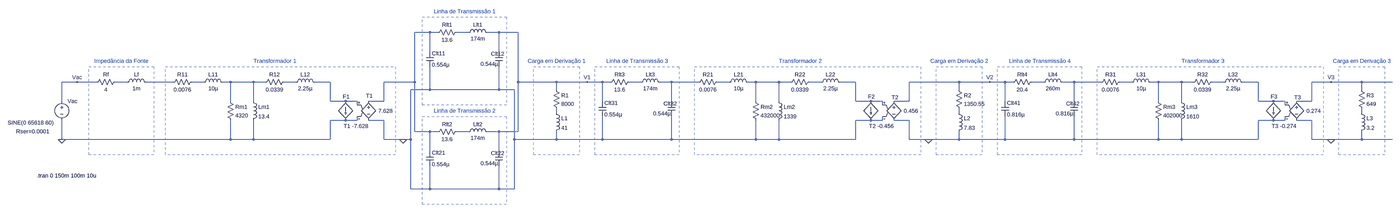
[diagram p0: schematic SEP.asc, whole sheet]
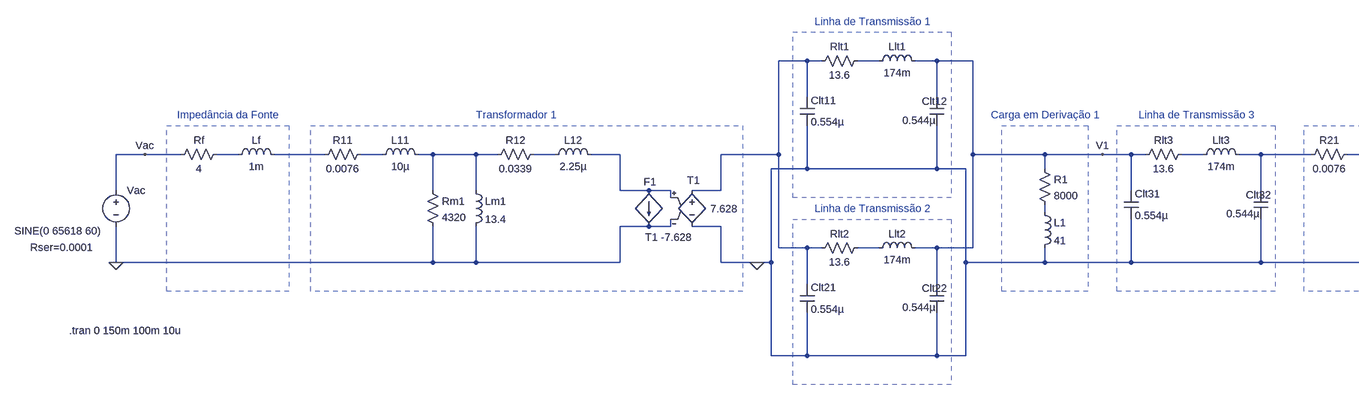
[diagram p1: schematic SEP.asc, part, row 1 of 1, column 1 of 2]
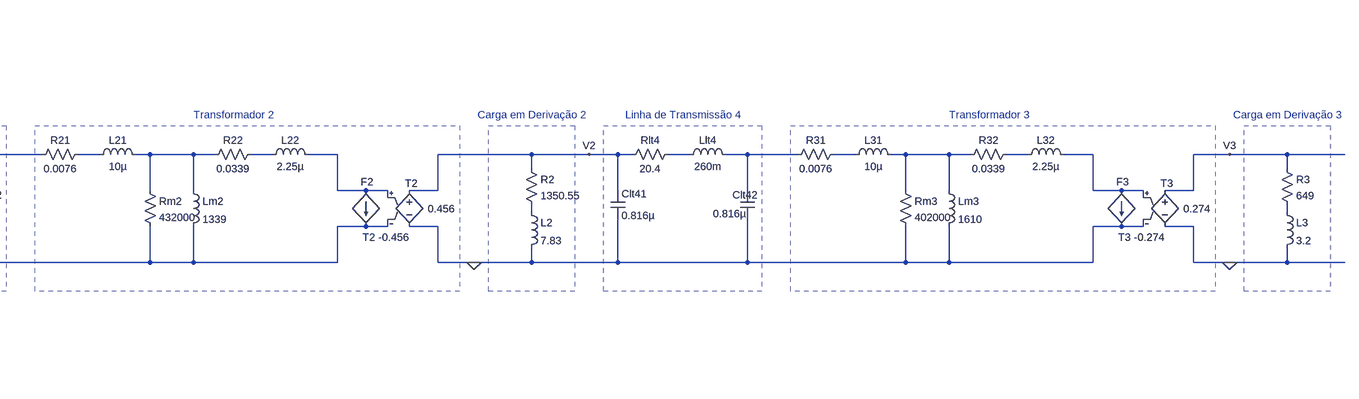
[diagram p2: schematic SEP.asc, part, row 1 of 1, column 2 of 2]
SEP.asc, the LTspice schematic file:
Version 4
SHEET 1 4708 936
WIRE 176 -112 112 -112
WIRE 208 -112 176 -112
WIRE 336 -112 288 -112
WIRE 464 -112 416 -112
WIRE 544 -112 464 -112
WIRE 176 -32 176 -112
WIRE 464 -32 464 -112
WIRE -1296 96 -1360 96
WIRE -1216 96 -1296 96
WIRE -1088 96 -1136 96
WIRE -896 96 -1008 96
WIRE -768 96 -816 96
WIRE -656 96 -688 96
WIRE -560 96 -656 96
WIRE -512 96 -560 96
WIRE -384 96 -432 96
WIRE -240 96 -304 96
WIRE 112 96 112 -112
WIRE 112 96 -16 96
WIRE 544 96 544 -112
WIRE 704 96 544 96
WIRE 832 96 704 96
WIRE 896 96 832 96
WIRE 928 96 896 96
WIRE 1056 96 1008 96
WIRE 1184 96 1136 96
WIRE 1296 96 1184 96
WIRE 1424 96 1376 96
WIRE 1536 96 1504 96
WIRE 1632 96 1536 96
WIRE 1680 96 1632 96
WIRE 1808 96 1760 96
WIRE 1952 96 1888 96
WIRE 2384 96 2176 96
WIRE 2512 96 2384 96
WIRE 2576 96 2512 96
WIRE 2608 96 2576 96
WIRE 2736 96 2688 96
WIRE 2864 96 2816 96
WIRE 2976 96 2864 96
WIRE 3104 96 3056 96
WIRE 3216 96 3184 96
WIRE 3312 96 3216 96
WIRE 3360 96 3312 96
WIRE 3488 96 3440 96
WIRE 3632 96 3568 96
WIRE 3936 96 3856 96
WIRE 4064 96 3936 96
WIRE 4192 96 4064 96
WIRE 176 128 176 32
WIRE 176 128 96 128
WIRE 464 128 464 32
WIRE 464 128 176 128
WIRE 528 128 464 128
WIRE 704 128 704 96
WIRE 2384 128 2384 96
WIRE 4064 128 4064 96
WIRE -1360 176 -1360 96
WIRE -656 176 -656 96
WIRE -560 176 -560 96
WIRE -240 176 -240 96
WIRE -176 176 -240 176
WIRE -128 176 -176 176
WIRE -16 176 -16 96
WIRE -16 176 -80 176
WIRE 896 176 896 96
WIRE 1184 176 1184 96
WIRE 1536 176 1536 96
WIRE 1632 176 1632 96
WIRE 1952 176 1952 96
WIRE 2016 176 1952 176
WIRE 2064 176 2016 176
WIRE 2176 176 2176 96
WIRE 2176 176 2112 176
WIRE 2576 176 2576 96
WIRE 2864 176 2864 96
WIRE 3216 176 3216 96
WIRE 3312 176 3312 96
WIRE 3632 176 3632 96
WIRE 3696 176 3632 176
WIRE 3744 176 3696 176
WIRE 3856 176 3856 96
WIRE 3856 176 3792 176
WIRE -128 192 -128 176
WIRE 2064 192 2064 176
WIRE 3744 192 3744 176
WIRE 704 224 704 208
WIRE 2384 224 2384 208
WIRE 4064 224 4064 208
WIRE -176 256 -240 256
WIRE -128 256 -128 240
WIRE -128 256 -176 256
WIRE -16 256 -80 256
WIRE 2016 256 1952 256
WIRE 2064 256 2064 240
WIRE 2064 256 2016 256
WIRE 2176 256 2112 256
WIRE 3696 256 3632 256
WIRE 3744 256 3744 240
WIRE 3744 256 3696 256
WIRE 3856 256 3792 256
WIRE 112 304 112 96
WIRE 176 304 112 304
WIRE 208 304 176 304
WIRE 336 304 288 304
WIRE 464 304 416 304
WIRE 544 304 544 96
WIRE 544 304 464 304
WIRE -1360 336 -1360 256
WIRE -656 336 -656 256
WIRE -656 336 -1360 336
WIRE -560 336 -560 256
WIRE -560 336 -656 336
WIRE -240 336 -240 256
WIRE -240 336 -560 336
WIRE -16 336 -16 256
WIRE 64 336 -16 336
WIRE 96 336 96 128
WIRE 96 336 64 336
WIRE 528 336 528 128
WIRE 704 336 704 304
WIRE 704 336 528 336
WIRE 896 336 896 240
WIRE 896 336 704 336
WIRE 1184 336 1184 240
WIRE 1184 336 896 336
WIRE 1536 336 1536 256
WIRE 1536 336 1184 336
WIRE 1632 336 1632 256
WIRE 1632 336 1536 336
WIRE 1952 336 1952 256
WIRE 1952 336 1632 336
WIRE 2176 336 2176 256
WIRE 2256 336 2176 336
WIRE 2384 336 2384 304
WIRE 2384 336 2256 336
WIRE 2576 336 2576 240
WIRE 2576 336 2384 336
WIRE 2864 336 2864 240
WIRE 2864 336 2576 336
WIRE 3216 336 3216 256
WIRE 3216 336 2864 336
WIRE 3312 336 3312 256
WIRE 3312 336 3216 336
WIRE 3632 336 3632 256
WIRE 3632 336 3312 336
WIRE 3856 336 3856 256
WIRE 3936 336 3856 336
WIRE 4064 336 4064 304
WIRE 4064 336 3936 336
WIRE 4192 336 4064 336
WIRE 176 384 176 304
WIRE 464 384 464 304
WIRE 96 544 96 336
WIRE 176 544 176 448
WIRE 176 544 96 544
WIRE 464 544 464 448
WIRE 464 544 176 544
WIRE 528 544 528 336
WIRE 528 544 464 544
FLAG -1360 336 0
FLAG 64 336 0
FLAG 2256 336 0
FLAG 832 96 V1
FLAG 2512 96 V2
FLAG -1296 96 Vac
FLAG 3936 96 V3
FLAG 3936 336 0
SYMBOL res -1120 80 R90
WINDOW 0 0 56 VBottom 2
WINDOW 3 32 56 VTop 2
SYMATTR InstName Rf
SYMATTR Value 4
SYMBOL ind -1104 112 R270
WINDOW 0 32 56 VTop 2
WINDOW 3 5 56 VBottom 2
SYMATTR InstName Lf
SYMATTR Value 1m
SYMBOL res -800 80 R90
WINDOW 0 0 56 VBottom 2
WINDOW 3 32 56 VTop 2
SYMATTR InstName R11
SYMATTR Value 0.0076
SYMBOL ind -784 112 R270
WINDOW 0 32 56 VTop 2
WINDOW 3 5 56 VBottom 2
SYMATTR InstName L11
SYMATTR Value 10µ
SYMBOL res -672 160 R0
SYMATTR InstName Rm1
SYMATTR Value 4320
SYMBOL ind -576 160 R0
SYMATTR InstName Lm1
SYMATTR Value 13.4
SYMBOL res -416 80 R90
WINDOW 0 0 56 VBottom 2
WINDOW 3 32 56 VTop 2
SYMATTR InstName R12
SYMATTR Value 0.0339
SYMBOL ind -400 112 R270
WINDOW 0 32 56 VTop 2
WINDOW 3 5 56 VBottom 2
SYMATTR InstName L12
SYMATTR Value 2.25µ
SYMBOL voltage -1360 160 R0
WINDOW 3 -226 106 Left 2
WINDOW 123 0 0 Left 0
WINDOW 39 -191 143 Left 2
SYMATTR Value SINE(0 65618 60)
SYMATTR SpiceLine Rser=0.0001
SYMATTR InstName Vac
SYMBOL res 688 112 R0
SYMATTR InstName R1
SYMATTR Value 8000
SYMBOL ind 688 208 R0
SYMATTR InstName L1
SYMATTR Value 41
SYMBOL cap 160 -32 R0
SYMATTR InstName Clt11
SYMATTR Value 0.554µ
SYMBOL res 304 -128 R90
WINDOW 0 0 56 VBottom 2
WINDOW 3 32 56 VTop 2
SYMATTR InstName Rlt1
SYMATTR Value 13.6
SYMBOL ind 320 -96 R270
WINDOW 0 32 56 VTop 2
WINDOW 3 5 56 VBottom 2
SYMATTR InstName Llt1
SYMATTR Value 174m
SYMBOL cap 448 -32 R0
WINDOW 0 -17 10 Left 2
WINDOW 3 -61 52 Left 2
SYMATTR InstName Clt12
SYMATTR Value 0.544µ
SYMBOL e -80 160 R0
WINDOW 0 -11 -6 Left 2
WINDOW 3 41 57 Left 2
SYMATTR InstName T1
SYMATTR Value 7.628
SYMBOL cap 160 384 R0
SYMATTR InstName Clt21
SYMATTR Value 0.554µ
SYMBOL res 304 288 R90
WINDOW 0 0 56 VBottom 2
WINDOW 3 32 56 VTop 2
SYMATTR InstName Rlt2
SYMATTR Value 13.6
SYMBOL ind 320 320 R270
WINDOW 0 32 56 VTop 2
WINDOW 3 5 56 VBottom 2
SYMATTR InstName Llt2
SYMATTR Value 174m
SYMBOL cap 448 384 R0
WINDOW 0 -17 10 Left 2
WINDOW 3 -61 52 Left 2
SYMATTR InstName Clt22
SYMATTR Value 0.544µ
SYMBOL cap 880 176 R0
SYMATTR InstName Clt31
SYMATTR Value 0.554µ
SYMBOL res 1024 80 R90
WINDOW 0 0 56 VBottom 2
WINDOW 3 32 56 VTop 2
SYMATTR InstName Rlt3
SYMATTR Value 13.6
SYMBOL ind 1040 112 R270
WINDOW 0 32 56 VTop 2
WINDOW 3 5 56 VBottom 2
SYMATTR InstName Llt3
SYMATTR Value 174m
SYMBOL cap 1168 176 R0
WINDOW 0 -17 10 Left 2
WINDOW 3 -61 52 Left 2
SYMATTR InstName Clt32
SYMATTR Value 0.544µ
SYMBOL res 1392 80 R90
WINDOW 0 0 56 VBottom 2
WINDOW 3 32 56 VTop 2
SYMATTR InstName R21
SYMATTR Value 0.0076
SYMBOL ind 1408 112 R270
WINDOW 0 32 56 VTop 2
WINDOW 3 5 56 VBottom 2
SYMATTR InstName L21
SYMATTR Value 10µ
SYMBOL res 1520 160 R0
SYMATTR InstName Rm2
SYMATTR Value 432000
SYMBOL ind 1616 160 R0
SYMATTR InstName Lm2
SYMATTR Value 1339
SYMBOL res 1776 80 R90
WINDOW 0 0 56 VBottom 2
WINDOW 3 32 56 VTop 2
SYMATTR InstName R22
SYMATTR Value 0.0339
SYMBOL ind 1792 112 R270
WINDOW 0 32 56 VTop 2
WINDOW 3 5 56 VBottom 2
SYMATTR InstName L22
SYMATTR Value 2.25µ
SYMBOL res 2368 112 R0
SYMATTR InstName R2
SYMATTR Value 1350.55
SYMBOL ind 2368 208 R0
SYMATTR InstName L2
SYMATTR Value 7.83
SYMBOL cap 2560 176 R0
SYMATTR InstName Clt41
SYMATTR Value 0.816µ
SYMBOL res 2704 80 R90
WINDOW 0 0 56 VBottom 2
WINDOW 3 32 56 VTop 2
SYMATTR InstName Rlt4
SYMATTR Value 20.4
SYMBOL ind 2720 112 R270
WINDOW 0 32 56 VTop 2
WINDOW 3 5 56 VBottom 2
SYMATTR InstName Llt4
SYMATTR Value 260m
SYMBOL cap 2848 176 R0
WINDOW 0 -17 10 Left 2
WINDOW 3 -61 52 Left 2
SYMATTR InstName Clt42
SYMATTR Value 0.816µ
SYMBOL res 3072 80 R90
WINDOW 0 0 56 VBottom 2
WINDOW 3 32 56 VTop 2
SYMATTR InstName R31
SYMATTR Value 0.0076
SYMBOL ind 3088 112 R270
WINDOW 0 32 56 VTop 2
WINDOW 3 5 56 VBottom 2
SYMATTR InstName L31
SYMATTR Value 10µ
SYMBOL res 3200 160 R0
SYMATTR InstName Rm3
SYMATTR Value 402000
SYMBOL ind 3296 160 R0
SYMATTR InstName Lm3
SYMATTR Value 1610
SYMBOL res 3456 80 R90
WINDOW 0 0 56 VBottom 2
WINDOW 3 32 56 VTop 2
SYMATTR InstName R32
SYMATTR Value 0.0339
SYMBOL ind 3472 112 R270
WINDOW 0 32 56 VTop 2
WINDOW 3 5 56 VBottom 2
SYMATTR InstName L32
SYMATTR Value 2.25µ
SYMBOL res 4048 112 R0
SYMATTR InstName R3
SYMATTR Value 649
SYMBOL ind 4048 208 R0
SYMATTR InstName L3
SYMATTR Value 3.2
SYMBOL e 3792 160 R0
WINDOW 0 -10 0 Left 2
WINDOW 3 41 57 Left 2
SYMATTR InstName T3
SYMATTR Value 0.274
SYMBOL e 2112 160 R0
WINDOW 0 -10 0 Left 2
WINDOW 3 41 57 Left 2
SYMATTR InstName T2
SYMATTR Value 0.456
SYMBOL f -176 176 R0
WINDOW 0 -12 -19 Left 2
WINDOW 3 -8 104 Left 2
SYMATTR InstName F1
SYMATTR Value T1 -7.628
SYMBOL f 2016 176 R0
WINDOW 0 -12 -19 Left 2
WINDOW 3 -8 104 Left 2
SYMATTR InstName F2
SYMATTR Value T2 -0.456
SYMBOL f 3696 176 R0
WINDOW 0 -12 -19 Left 2
WINDOW 3 -8 104 Left 2
SYMATTR InstName F3
SYMATTR Value T3 -0.274
TEXT -560 8 Left 2 ;Transformador 1
TEXT -1464 488 Left 2 !.tran 0 150m 100m 10u
TEXT -1224 8 Left 2 ;Impedância da Fonte
TEXT 192 -200 Left 2 ;Linha de Transmissão 1
TEXT 192 216 Left 2 ;Linha de Transmissão 2
TEXT 584 8 Left 2 ;Carga em Derivação 1
TEXT 912 8 Left 2 ;Linha de Transmissão 3
TEXT 1632 8 Left 2 ;Transformador 2
TEXT 2264 8 Left 2 ;Carga em Derivação 2
TEXT 2592 8 Left 2 ;Linha de Transmissão 4
TEXT 3312 8 Left 2 ;Transformador 3
TEXT 3944 8 Left 2 ;Carga em Derivação 3
RECTANGLE Normal -976 400 -1248 32 2
RECTANGLE Normal 496 192 144 -176 2
RECTANGLE Normal 496 608 144 240 2
RECTANGLE Normal 800 400 608 32 2
RECTANGLE Normal 1216 400 864 32 2
RECTANGLE Normal 2480 400 2288 32 2
RECTANGLE Normal 2896 400 2544 32 2
RECTANGLE Normal 4160 400 3968 32 2
RECTANGLE Normal 32 400 -928 32 2
RECTANGLE Normal 2224 400 1280 32 2
RECTANGLE Normal 3904 400 2960 32 2

The netlist it stands for:
* SEP.asc
Rf N003 Vac 4
Lf N003 N004 1m
R11 N005 N004 0.0076
L11 N005 N006 10µ
Rm1 N006 0 4320
Lm1 N006 0 13.4
R12 N007 N006 0.0339
L12 N007 N008 2.25µ
Vac Vac 0 SINE(0 65618 60) Rser=0.0001
R1 V1 N021 8000
L1 N021 0 41
Clt11 N001 0 0.554µ
Rlt1 N002 N001 13.6
Llt1 N002 V1 174m
Clt12 V1 0 0.544µ
E§T1 N001 0 N008 0 7.628
Clt21 N001 0 0.554µ
Rlt2 N024 N001 13.6
Llt2 N024 V1 174m
Clt22 V1 0 0.544µ
Clt31 V1 0 0.554µ
Rlt3 N009 V1 13.6
Llt3 N009 N010 174m
Clt32 N010 0 0.544µ
R21 N011 N010 0.0076
L21 N011 N012 10µ
Rm2 N012 0 432000
Lm2 N012 0 1339
R22 N013 N012 0.0339
L22 N013 N014 2.25µ
R2 V2 N022 1350.55
L2 N022 0 7.83
Clt41 V2 0 0.816µ
Rlt4 N015 V2 20.4
Llt4 N015 N016 260m
Clt42 N016 0 0.816µ
R31 N017 N016 0.0076
L31 N017 N018 10µ
Rm3 N018 0 402000
Lm3 N018 0 1610
R32 N019 N018 0.0339
L32 N019 N020 2.25µ
R3 V3 N023 649
L3 N023 0 3.2
E§T3 V3 0 N020 0 0.274
E§T2 V2 0 N014 0 0.456
F1 N008 0 T1 -7.628
F2 N014 0 T2 -0.456
F3 N020 0 T3 -0.274
* Transformador 1
.tran 0 150m 100m 10u
* Impedância da Fonte
* Linha de Transmissão 1
* Linha de Transmissão 2
* Carga em Derivação 1
* Linha de Transmissão 3
* Transformador 2
* Carga em Derivação 2
* Linha de Transmissão 4
* Transformador 3
* Carga em Derivação 3
.backanno
.end

* Results of the author's LTspice run, read from the files saved beside the schematic
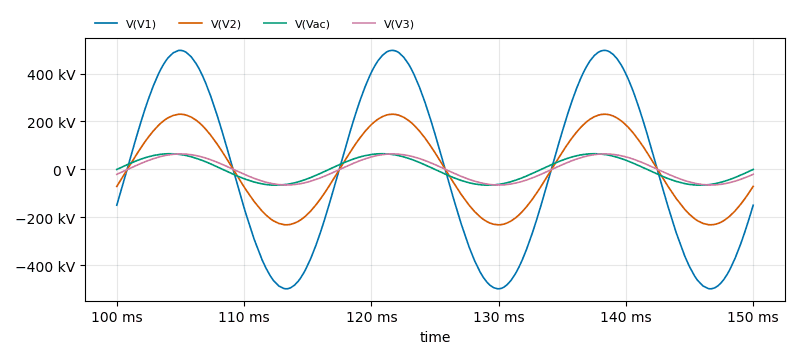
[diagram p3: Transient Analysis of SEP.asc, plotted from the saved traces]
* Transient Analysis, 1 run:
*   V(V1): min -497.7 kV, max 496.6 kV, average -464.4 V, rms 351.6 kV, last -149.1 kV
*   V(V2): min -230.8 kV, max 230.3 kV, average -217.1 V, rms 163.1 kV, last -70.49 kV
*   V(Vac): min -65.58 kV, max 65.62 kV, average 17.5 V, rms 46.39 kV, last -442.9 mV
*   V(V3): min -64.85 kV, max 64.71 kV, average -61.02 V, rms 45.81 kV, last -20.31 kV